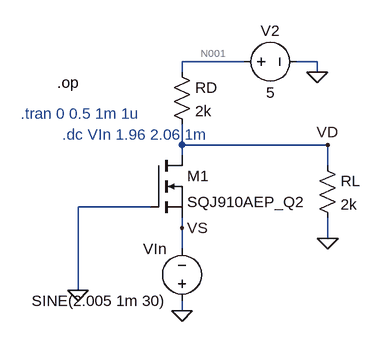
[diagram p0: schematic mos_cg_vgs.asc]
mos_cg_vgs.asc, the LTspice schematic file:
Version 4.1
SHEET 1 880 680
WIRE 320 -48 224 -48
WIRE 432 -48 400 -48
WIRE 224 -32 224 -48
WIRE 432 -32 432 -48
WIRE 224 80 224 48
WIRE 448 80 224 80
WIRE 224 96 224 80
WIRE 448 112 448 80
WIRE 176 176 64 176
WIRE 224 208 224 192
WIRE 448 224 448 192
WIRE 224 240 224 208
WIRE 64 304 64 176
WIRE 224 336 224 320
FLAG 224 336 0
FLAG 448 224 0
FLAG 432 -32 0
FLAG 448 80 VD
FLAG 64 304 0
FLAG 224 208 VS
SYMBOL nmos 176 96 R0
SYMATTR InstName M1
SYMATTR Value SQJ910AEP_Q2
SYMBOL res 208 -48 R0
SYMATTR InstName RD
SYMATTR Value 2k
SYMBOL res 432 96 R0
SYMATTR InstName RL
SYMATTR Value 2k
SYMBOL voltage 304 -48 R270
WINDOW 0 32 56 VTop 2
WINDOW 3 -32 56 VBottom 2
WINDOW 123 0 0 Left 0
WINDOW 39 0 0 Left 0
SYMATTR InstName V2
SYMATTR Value 5
SYMBOL voltage 224 336 R180
WINDOW 0 24 96 Left 2
WINDOW 3 24 16 Left 2
WINDOW 123 0 0 Left 0
WINDOW 39 0 0 Left 0
SYMATTR InstName VIn
SYMATTR Value SINE(2.005 1m 30)
TEXT 32 -16 Left 2 !.op
TEXT -24 32 Left 2 ;.tran 0 0.5 1m 1u
TEXT 40 64 Left 2 ;.dc VIn 1.96 2.06 1m

The netlist it stands for:
* mos_cg_vgs.asc
M1 VD 0 VS VS SQJ910AEP_Q2
RD N001 VD 2k
RL VD 0 2k
V2 N001 0 5
VIn 0 VS SINE(2.005 1m 30)
.model NMOS NMOS
.model PMOS PMOS
.lib standard.mos
.op
* .tran 0 0.5 1m 1u
* .dc VIn 1.96 2.06 1m
.backanno
.end

* Results of the author's LTspice run, read from the files saved beside the schematic
* Operating Point:
*   V(vs) = -2.005 V
*   V(vd) = 1.725 V
*   V(n001) = 5 V
*   Id(M1) = 775.2 µA
*   Ig(M1) = -283.9 pA
*   Is(M1) = -775.2 µA
*   I(RL) = 862.4 µA
*   I(VIn) = -775.2 µA
*   I(RD) = 1.638 mA
*   I(V2) = -1.638 mA